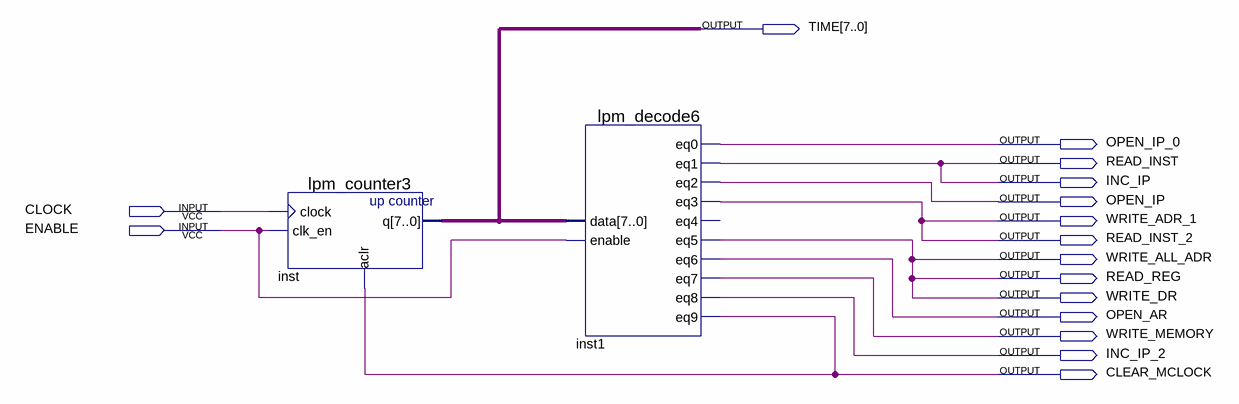
[diagram p0: schematic sheet]
// Quartus schematic MOV_ADR_REG.bdf as structural Verilog: 2 symbols, 16 pins
module MOV_ADR_REG (
  input  CLOCK,
  input  ENABLE,
  output [7:0] TIME,
  output OPEN_IP_0,
  output READ_INST,
  output INC_IP,
  output OPEN_IP,
  output WRITE_ADR_1,
  output READ_INST_2,
  output WRITE_ALL_ADR,
  output READ_REG,
  output WRITE_DR,
  output OPEN_AR,
  output WRITE_MEMORY,
  output INC_IP_2,
  output CLEAR_MCLOCK
);

  lpm_counter3 inst (.clock(CLOCK), .clk_en(ENABLE), .aclr(CLEAR_MCLOCK), .q(TIME));
  lpm_decode6 inst1 (
    .data(TIME), .enable(ENABLE), .eq0(OPEN_IP_0), .eq1(INC_IP), .eq2(OPEN_IP), .eq3(READ_INST_2),
    .eq5(READ_REG), .eq6(OPEN_AR), .eq7(WRITE_MEMORY), .eq8(INC_IP_2), .eq9(CLEAR_MCLOCK));  // open: eq4

  assign READ_INST = INC_IP;
  assign WRITE_ADR_1 = READ_INST_2;
  assign WRITE_ALL_ADR = READ_REG;
  assign WRITE_DR = READ_REG;
endmodule
